# EAGLE design LooSensorNodeV0 (EAGLE 8.6.0)
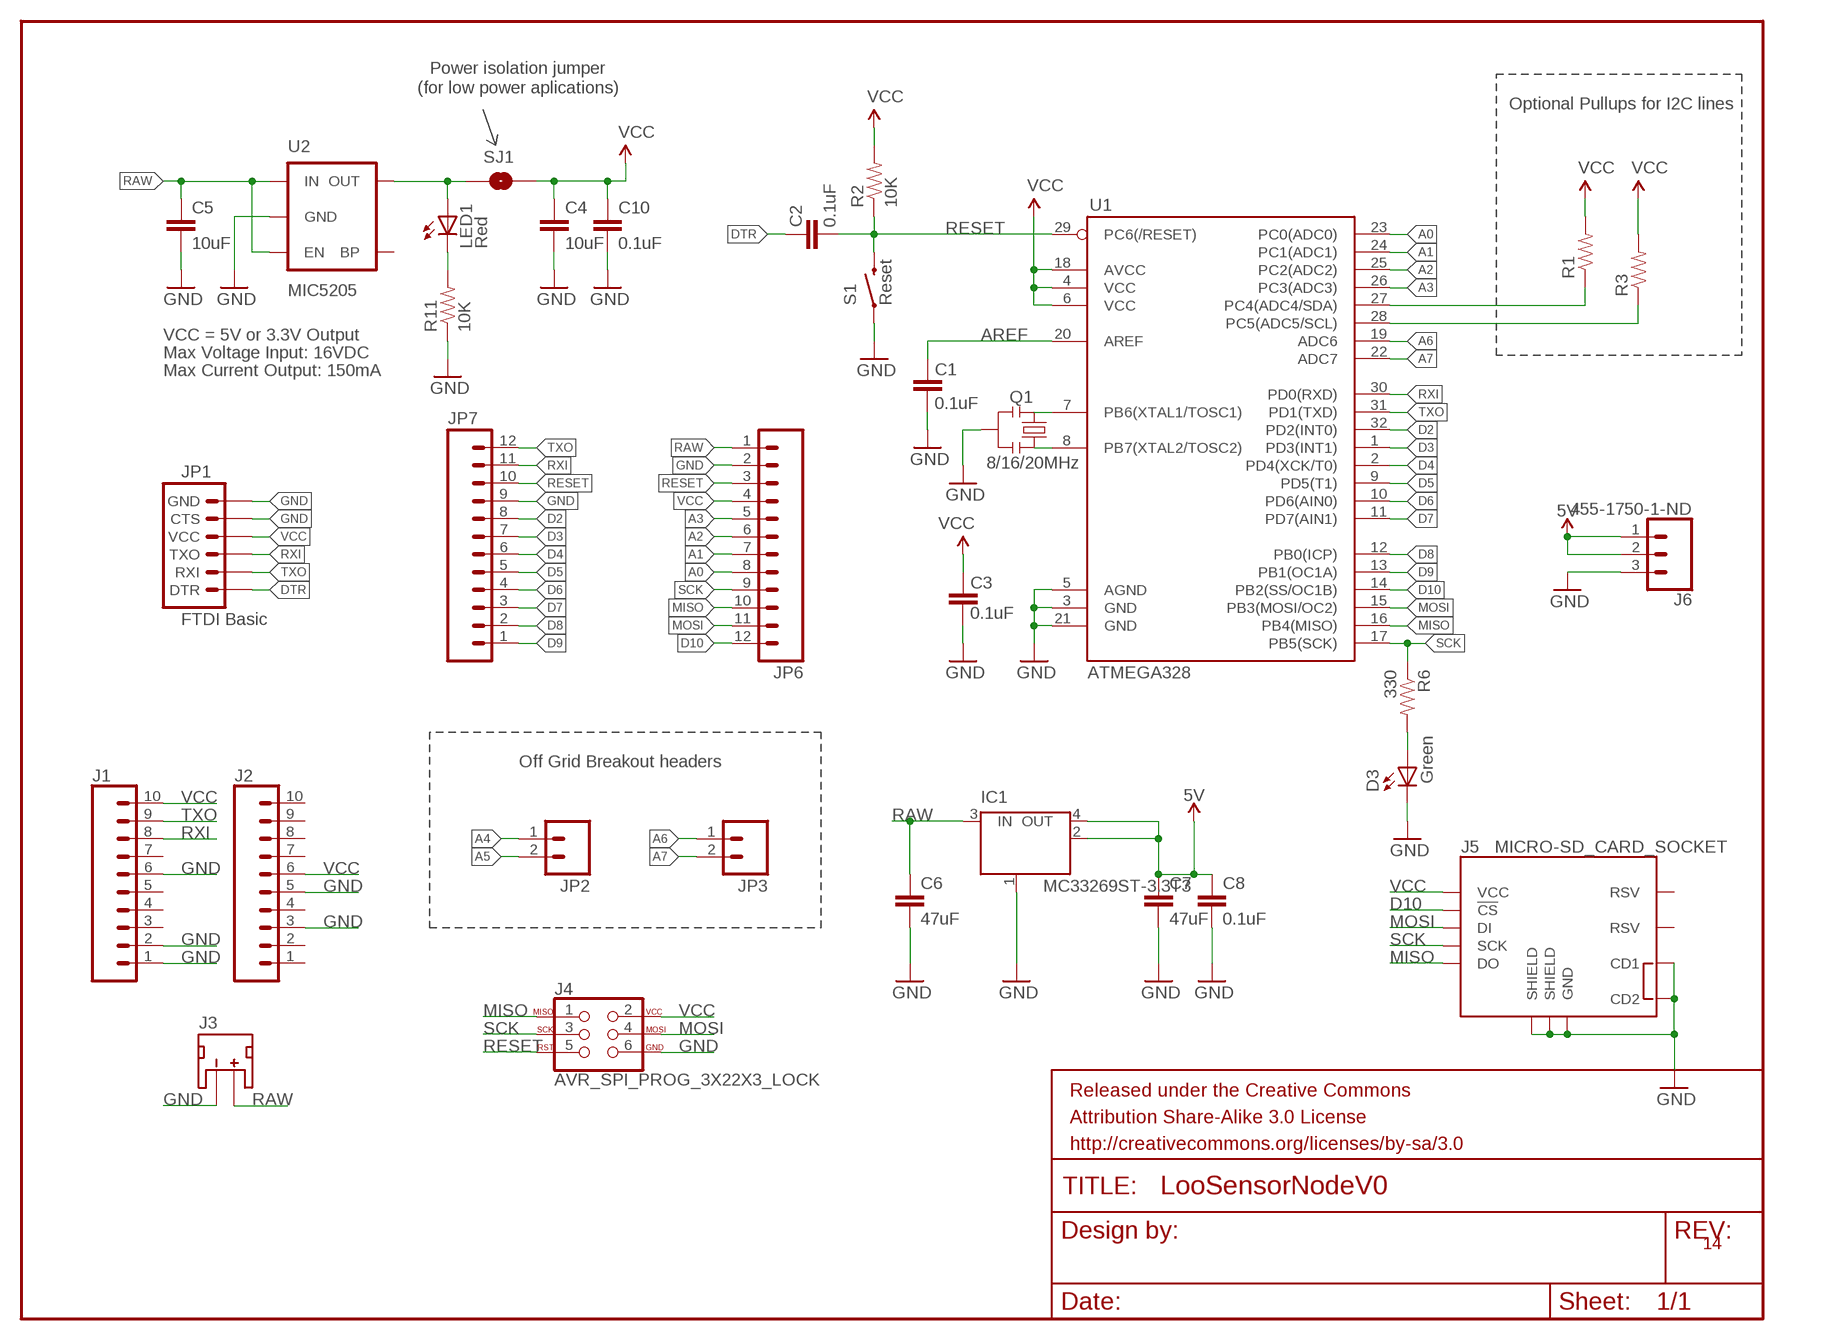
[diagram p0: schematic, sheet 1]

## Parts
C1  0.1uF  CAP0603-CAP  [0603-CAP]
C2  0.1uF  CAP0603-CAP  [0603-CAP]
C3  0.1uF  CAP0603-CAP  [0603-CAP]
C4  10uF  10UF-0603-6.3V-20%  [0603]
C5  10uF  10UF-0603-6.3V-20%  [0603]
C6  47uF  10UF-1210-50V-20%  [1210]
C7  47uF  10UF-1210-50V-20%  [1210]
C8  0.1uF  0.1UF-0603-25V-5%  [0603]
C10  0.1uF  CAP0603-CAP  [0603-CAP]
D3  Green  LED  [0603-LED-ALT1]
FRAME1  FRAME-LETTER  [CREATIVE_COMMONS]
IC1  MC33269ST-3.3T3  [SOT223]
J1  CONN_102MM  [1X10-2MM]
J2  CONN_102MM  [1X10-2MM]
J3  JST_2MM_MALE  [JST-2-SMD]
J4  AVR_SPI_PROG_3X22X3_LOCK  [2X3_LOCK]
J5  MICRO-SD_CARD_SOCKET  [MICRO-SD-SOCKET]
J6  455-1750-1-ND  CONN_03  [1X03]
JP1  FTDI Basic  ARDUINO_SERIAL_PROGRAMPTH  [1X06]
JP2  M02PTH  [1X02]
JP3  M02PTH  [1X02]
JP6  M12PTH  [1X12]
JP7  M12PTH  [1X12]
LED1  Red  LED  [0603-LED-ALT1]
Q1  8/16/20MHz  RESONATOR1:1  [RESONATOR-SMD-1:1]
R1  RESISTOR0603-RES  [0603-RES]
R2  10K  RESISTOR0603-RES  [0603-RES]
R3  RESISTOR0603-RES  [0603-RES]
R6  330  RESISTOR0603-RES  [0603-RES]
R11  10K  RESISTOR0603-RES  [0603-RES]
S1  Reset  SWITCH-MOMENTARY-2SMD-ALT01  [TACTILE-SWITCH-SMD-ALT01]
SJ1  SOLDERJUMPERNC  [SJ_2S]
U1  ATMEGA328  ATMEGA168  [TQFP32-08]
U2  MIC5205  V_REG_LDOSMD  [SOT23-5]

## Nets
5V: C7.1 C8.1 IC1.2(OUT) IC1.4(OUT) J6.1 J6.2
A0: JP6.8 U1.23(PC0(ADC0))
A1: JP6.7 U1.24(PC1(ADC1))
A2: JP6.6 U1.25(PC2(ADC2))
A3: JP6.5 U1.26(PC3(ADC3))
A4: JP2.1 R1.1 U1.27(PC4(ADC4/SDA))
A5: JP2.2 R3.1 U1.28(PC5(ADC5/SCL))
A6: JP3.1 U1.19(ADC6)
A7: JP3.2 U1.22(ADC7)
AREF: C1.2 U1.20(AREF)
D2: JP7.8 U1.32(PD2(INT0))
D3: JP7.7 U1.1(PD3(INT1))
D4: JP7.6 U1.2(PD4(XCK/T0))
D5: JP7.5 U1.9(PD5(T1))
D6: JP7.4 U1.10(PD6(AIN0))
D7: JP7.3 U1.11(PD7(AIN1))
D8: JP7.2 U1.12(PB0(ICP))
D9: JP7.1 U1.13(PB1(OC1A))
D10: J5.CS(!CS) JP6.12 U1.14(PB2(SS/OC1B))
DTR: C2.2 JP1.1(DTR)
GND [vcc]: C1.1 C3.1 C4.2 C5.2 C6.2 C7.2 C8.2 C10.2 D3.C IC1.1(GND/ADJ) J1.1 J1.2 J1.6 J2.3 J2.5 J3.1(-) J4.6 J5.CD1 J5.CD2 J5.GND J5.GND1(SHIELD) J5.GND3(SHIELD) J6.3 JP1.5(CTS) JP1.6(GND) JP6.2 JP7.9 Q1.2 R11.1 S1.1 S1.2 U1.3(GND) U1.5(AGND) U1.21(GND) U2.2(GND)
MISO: J4.1 J5.DO JP6.10 U1.16(PB4(MISO))
MOSI: J4.4 J5.DI JP6.11 U1.15(PB3(MOSI/OC2))
N$1: Q1.3 U1.8(PB7(XTAL2/TOSC2))
N$2: Q1.1 U1.7(PB6(XTAL1/TOSC1))
N$3: LED1.A SJ1.1 U2.5(OUT)
N$4: LED1.C R11.2
N$7: D3.A R6.2
RAW [vcc]: C5.1 C6.1 IC1.3(IN) J3.2(+) JP6.1 U2.1(IN) U2.3(EN)
RESET: C2.1 J4.5 JP6.3 JP7.10 R2.1 S1.3 S1.4 U1.29(PC6(/RESET))
RXI: J1.8 JP1.3(TXO) JP7.11 U1.30(PD0(RXD))
SCK: J4.3 J5.SCLK(SCK) JP6.9 R6.1 U1.17(PB5(SCK))
TXO: J1.9 JP1.2(RXI) JP7.12 U1.31(PD1(TXD))
VCC: C3.2 C4.1 C10.1 J1.10 J2.6 J4.2 J5.VCC JP1.4(VCC) JP6.4 R1.2 R2.2 R3.2 SJ1.2 U1.4(VCC) U1.6(VCC) U1.18(AVCC)
Unconnected: J1.3 J1.4 J1.5 J1.7 J2.1 J2.2 J2.4 J2.7 J2.8 J2.9 J2.10 J3.NC1(PAD1) J3.NC2(PAD2) J5.RSV1(RSV) J5.RSV2(RSV) U2.4(BP)

## Notes on the sheet
- Power isolation jumper
- (for low power aplications)
- Optional Pullups for I2C lines
- VCC = 5V or 3.3V Output
- Max Voltage Input: 16VDC
- Max Current Output: 150mA
- Off Grid Breakout headers
- 14

## Library data of the parts
C1-C3 C10 = SparkFun:CAP: Capacitor Standard 0603 ceramic capacitor, and 0.1" leaded capacitor.
C4 C5 = SparkFun-Capacitors:10UF: 10.0µF ceramic capacitors A capacitor is a passive two-terminal electrical component used to store electrical energy temporarily in an electric field.; PROD_ID: CAP-11015
C6 C7 = SparkFun-Capacitors:10UF: 10.0µF ceramic capacitors A capacitor is a passive two-terminal electrical component used to store electrical energy temporarily in an electric field.; PROD_ID: CAP-09824; VALUE: 10uF
C8 = SparkFun-Capacitors:0.1UF: 0.1µF ceramic capacitors A capacitor is a passive two-terminal electrical component used to store electrical energy temporarily in an electric field.; PROD_ID: CAP-08604
D3 LED1 = Testing:LED: LEDs Standard schematic elements and footprints for 5mm, 3mm, 1206, and 0603 sized LEDs. 5mm - Spark Fun Electronics SKU : COM-00529 (and others)
FRAME1 = SparkFun-Aesthetics:FRAME-LETTER: Schematic Frame Standard 8.5x11 US Letter frame
IC1 = linear:MC33269ST*: Adjustable Output Low Dropout Voltage Regulator 800 mA Source: http://www.onsemi.com/pub/Collateral/MC33269-D.PDF
J1 J2 = SparkFun-Connectors:CONN_10: Multi connection point. Often used as Generic Header-pin footprint for 0.1 inch spaced/style header connections On any of the 0.1 inch spaced packages, you can populate with these: Break Away Headers - Straight <https://www.sparkfun.com/products/116> (PRT-00116) Break Away Male Headers - Right Angle <https://www.sparkfun.com/products/553> (PRT-00553) Female Headers <https://www.sparkfun.com/products/115> (PRT-00115) Break Away Headers - Machine Pin <https://www.sparkfun.com/products/117> (PRT-00117) Break Away Female Headers - Swiss Machine Pin <https://www.sparkfun.com/products/743> (PRT-00743) Arduino Stackable Header - 10 Pin <https://www.sparkfun.com/products/11376> (PRT-11376) For SCREWTERMINALS and SPRING TERMINALS visit here: Screw Terimnals on SparkFun.com <https://www.sparkfun.com/search/results?term=Screw+Terminals> (5mm/3.5mm/2.54mm spacing) This device is also useful as a general connection point to wire up your design to another part of your project. Our various solder wires solder well into these plated through hole pads. Hook-Up Wire - Assortment (Stranded, 22 AWG) <https://www.sparkfun.com/products/11375> (PRT-11375) Hook-Up Wire - Assortment (Solid Core, 22 AWG) <https://www.sparkfun.com/products/11367> (PRT-11367) View the entire wire category on our website here <https://www.sparkfun.com/categories/141> Special notes: Molex polarized connector foot print use with SKU : PRT-08231 with associated crimp pins and housings. 1MM SMD Version SKU: PRT-10208 NOTES ON THE VARIANTS LOCK and LOCK_LONGPADS... This footprint was designed to help hold the alignment of a through-hole component (i.e. 6-pin header) while soldering it into place. You may notice that each hole has been shifted either up or down by 0.005 of an inch from it's more standard position (which is a perfectly straight line). This slight alteration caused the pins (the squares in the middle) to touch the edges of the holes. Because they are alternating, it causes a "brace" to hold the component in place. 0.005 has proven to be the perfect amount of "off-center" position when using our standard breakaway headers. Although looks a little odd when you look at the bare footprint, once you have a header in there, the alteration is very hard to notice. Also,if you push a header all the way into place, it is covered up entirely on the bottom side.; PROD_ID: CONN-08875; SF_ID: PRT-08272
J3 = SparkFun-Connectors:JST_2MM_MALE: JST 2MM MALE RA CONNECTOR Two pin, compact surface mount connector. Commonly used as a battery input connection point. We really like the solid locking feeling and high current rating on these small connectors. We use these all the time as battery connectors. Mates to single-cell LiPo batteries. Here is the connector we sell at SparkFun: JST Right Angle Connector - White <https://www.sparkfun.com/products/8612> (PRT-08612) Datasheet <http://www.sparkfun.com/datasheets/Prototyping/Connectors/JST-Horizontal.pdf> It was used on these SparkFun products: SparkFun MOSFET Power Controller <https://www.sparkfun.com/products/11214> (PRT-11214) SparkFun Battery Babysitter - LiPo Battery Manager <https://www.sparkfun.com/products/13777> (PRT-13777) And many, many others that required a lipo battery connection.; PROD_ID: CONN-11443; SF_ID: PRT-08612
J4 = SparkFun-Connectors:AVR_SPI_PROG_3X2: AVR ISP 6 Pin This is the reduced ISP connector for AVR programming. Common on Arduino. This footprint will take up less PCB space and can be used with a 10-pin to 6-pin adapter such as SKU: BOB-08508 **Special note about "TEST_POINT" package. The stop mask is on the top side, so if you want your programming test points to be on the bottom of your board, make sure to place this package on the bottom side of the board. This also ensure that the orientation to program from the bottom side will be correct. SparkFun Products: SparkFun ISP Pogo Adapter <https://www.sparkfun.com/products/11591> - NS Tiny AVR Programmer <https://www.sparkfun.com/products/11801> -PTH
J5 = SparkFun-Connectors:MICRO-SD_CARD_SOCKET: microSD Socket for Transflash Push-push type µSD socket. tDoc lines correctly indicate media card edge positions when inserting (unlocked, locked, depressed). NOTE: CD1 and CD2 are connected internally, and the default detect state of the socket is detect pin to ground. SparkFun Products: WAV Trigger <https://www.sparkfun.com/products/13660> CAN-Bus Shield <https://www.sparkfun.com/products/13262> SparkFun Level Shifing microSD Breakout <https://www.sparkfun.com/products/13743>; PROD_ID: CONN-07820; SF_ID: PRT-00127
J6 = SparkFun-Connectors:CONN_03: Multi connection point. Often used as Generic Header-pin footprint for 0.1 inch spaced/style header connections On any of the 0.1 inch spaced packages, you can populate with these: Break Away Headers - Straight <https://www.sparkfun.com/products/116> (PRT-00116) Break Away Male Headers - Right Angle <https://www.sparkfun.com/products/553> (PRT-00553) Female Headers <https://www.sparkfun.com/products/115> (PRT-00115) Break Away Headers - Machine Pin <https://www.sparkfun.com/products/117> (PRT-00117) Break Away Female Headers - Swiss Machine Pin <https://www.sparkfun.com/products/743> (PRT-00743) Stackable Header - 3 Pin (Female, 0.1") <https://www.sparkfun.com/products/13875> (PRT-13875) For SCREWTERMINALS and SPRING TERMINALS visit here: Screw Terimnals on SparkFun.com <https://www.sparkfun.com/search/results?term=Screw+Terminals> (5mm/3.5mm/2.54mm spacing) This device is also useful as a general connection point to wire up your design to another part of your project. Our various solder wires solder well into these plated through hole pads. Hook-Up Wire - Assortment (Stranded, 22 AWG) <https://www.sparkfun.com/products/11375> (PRT-11375) Hook-Up Wire - Assortment (Solid Core, 22 AWG) <https://www.sparkfun.com/products/11367> (PRT-11367) View the entire wire category on our website here <https://www.sparkfun.com/categories/141> Special notes: Molex polarized connector foot print use with SKU : PRT-08232 with associated crimp pins and housings.; PROD_ID: XXX-00000
JP1 = SparkFun:ARDUINO_SERIAL_PROGRAM
JP2 JP3 = SparkFun:M02: Header 2 Standard 2-pin 0.1" header. Use with straight break away headers (SKU : PRT-00116), right angle break away headers (PRT-00553), swiss pins (PRT-00743), machine pins (PRT-00117), and female headers (PRT-00115). Molex polarized connector foot print use with SKU : PRT-08233 with associated crimp pins and housings.
JP6 JP7 = SparkFun:M12: Header 12 Standard 12-pin 0.1" header. Use with straight break away headers (SKU : PRT-00116), right angle break away headers (PRT-00553), swiss pins (PRT-00743), machine pins (PRT-00117), and female headers (PRT-00115).
Q1 = Testing:RESONATOR: Resonator Small SMD resonator. This is the itty bitty 10/20MHz resonators with built in caps. CSTCE10M0G55 and CSTCE20M0V53. Footprint for SMD has been used in SFE production for years, and does work okay. 1:1 is an attempt to get larger fillets on the sides so it will be easier to inspect these solders in our AOI machine. The pads have been minimized to match the actual metal under the resonator. To see this relation, it includes an image import of the bottom side of the component. Imported to scale on layer 200.
R1-R3 R6 R11 = SparkFun:RESISTOR: Resistor Basic schematic elements and footprints for 0603, 1206, and PTH resistors.
S1 = Testing:SWITCH-MOMENTARY-2: Various NO switches- pushbuttons, reed, etc
SJ1 = SparkFun-Passives:SOLDERJUMPER: Solder Jumper Standard SMD solder jumper. Used to automate production. Two varients : Normally Open and Normally Closed are the same, but have different paste layers. NC will have a large amount of paste and should jumper during reflow.
U1 = SparkFun:ATMEGA168
U2 = SparkFun:V_REG_LDO: Voltage Regulator LDO Standard 150mA LDO voltage regulator in SOT-23 layout. Micrel part MIC5205. BP (by-pass) pin is used to lower output noise with 470pF cap.

## Net classes
0 default: width 0.203 mm
1 vcc: width 0.254 mm

## Board
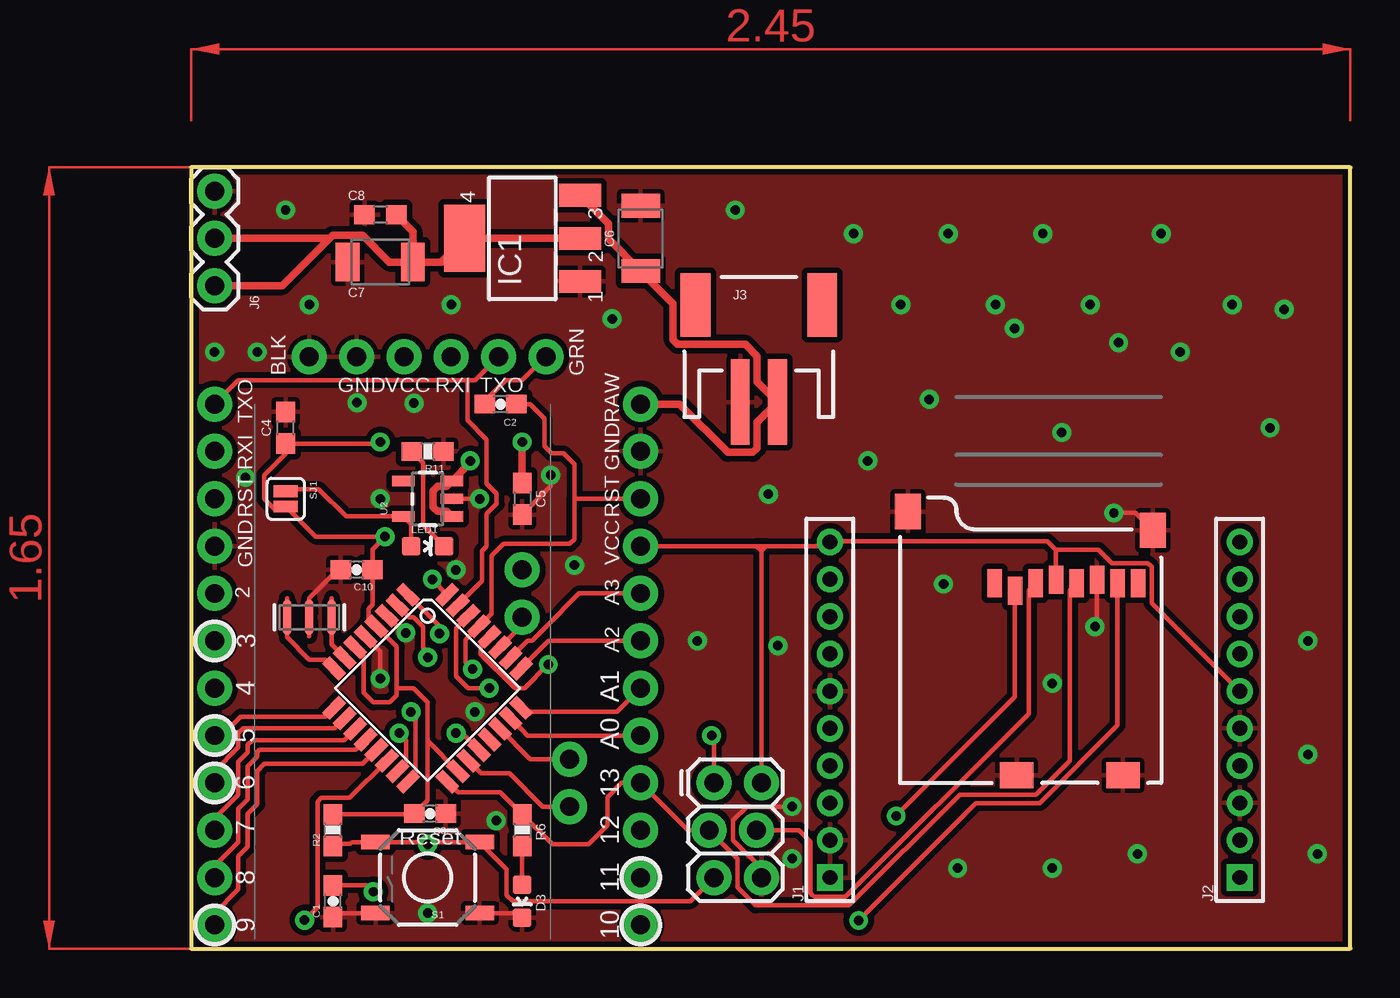
[diagram p1: board, top side]
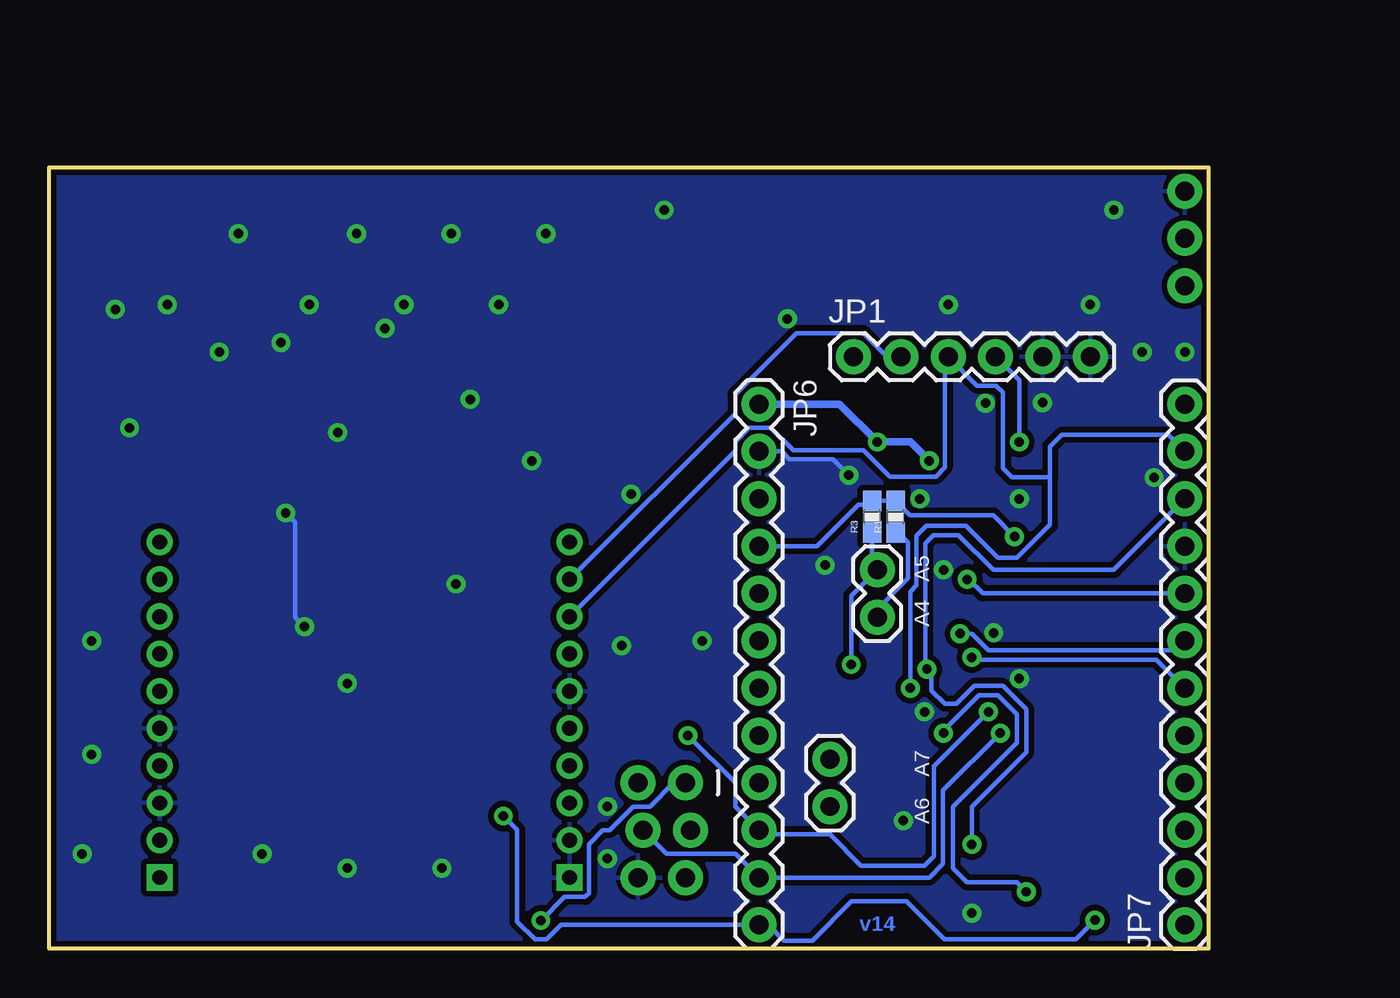
[diagram p2: board, bottom side, seen from below]

Size 62.23 x 41.91 mm. Coordinates in mm from the lower left corner, seen from the top.
Outline: 0,41.91 0,0 62.23,0 62.23,41.91 0,41.91
Copper layers (1*16): Top 0.035mm / dielectric 1.5mm / Bottom 0.035mm
Design rules "SparkFun-2-layer *": minimum track width 7mil, minimum drill 15mil, track to track 8mil, track to pad 8mil, pad to pad 8mil, via to via 8mil, smd to smd 8mil, copper to edge 8mil, drill to drill 8mil, minimum pad ring 12mil, minimum via ring 10mil, stop-mask expansion 4mil, vias tented up to drill 20mil, thermal gap 10mil

### Footprints (pad centres in the part's own frame; a part is rotated, then mirrored left to right if it is on the bottom)
0603-CAP = smd 1.1 x 1: 1 -0.85,0; 2 0.85,0
0603 = smd 1.1 x 1: 1 -0.85,0; 2 0.85,0
1210 = smd 1.27 x 2.06: 1 -1.755,0; 2 1.755,0
0603-LED-ALT1 = smd 1 x 1: A 0,-0.877; C 0,0.877
SOT223 = smd 1.219 x 2.235: 1 -2.311,-3.099; 2 0,-3.099; 3 2.311,-3.099 | smd 3.6 x 2.2: 4 0,3.099
1X10-2MM = drill 0.8 square: 1 0,0 | drill 0.8: 2 2,0; 3 4,0; 4 6,0; 5 8,0; 6 10,0; 7 12,0; 8 14,0; 9 16,0; 10 18,0
JST-2-SMD = smd 1 x 4.6: 1 -1,-3.7; 2 1,-3.7 | smd 1.6 x 3.4: NC1 -3.4,1.5; NC2 3.4,1.5
2X3_LOCK = drill 1.016 pad 1.88: 1 0,0.127; 2 0,2.667; 3 2.54,-0.127; 4 2.54,2.413; 5 5.08,0.127; 6 5.08,2.667
MICRO-SD-SOCKET = smd 1.8 x 1.4: CD1 -2.05,0.4; CD2 -7.75,0.4 | smd 0.8 x 1.5: CS -7.84,10.3; DI -6.74,10.7; DO -2.34,10.7; GND -3.44,10.9; RSV1 -8.94,10.7; RSV2 -1.24,10.7; SCLK -4.54,10.7; VCC -5.64,10.9 | smd 1.4 x 1.9: GND1 -13.6,14.55; GND3 -0.45,13.55
1X03 = drill 1.016 pad 1.88: 1 0,0; 2 2.54,0; 3 5.08,0
1X06 = drill 1.016 pad 1.88: 1 0,0; 2 2.54,0; 3 5.08,0; 4 7.62,0; 5 10.16,0; 6 12.7,0
1X02 = drill 1.016 pad 1.88: 1 0,0; 2 2.54,0
1X12 = drill 1.016 pad 1.88: 1 0,0; 2 2.54,0; 3 5.08,0; 4 7.62,0; 5 10.16,0; 6 12.7,0; 7 15.24,0; 8 17.78,0; 9 20.32,0; 10 22.86,0; 11 25.4,0; 12 27.94,0
RESONATOR-SMD-1:1 = smd 0.45 x 1.905: 1 -1.2,0; 2 0,0; 3 1.2,0
0603-RES = smd 1.1 x 1: 1 -0.85,0; 2 0.85,0
TACTILE-SWITCH-SMD-ALT01 = smd 1.524 x 0.762: 1 -2.794,1.905; 2 2.794,1.905; 3 -2.794,-1.905; 4 2.794,-1.905
SJ_2S = smd 0.635 x 1.27: 1 -0.412,0; 2 0.412,0
TQFP32-08 = smd 1.27 x 0.559: 1 -4.293,2.8; 2 -4.293,2; 3 -4.293,1.2; 4 -4.293,0.4; 5 -4.293,-0.4; 6 -4.293,-1.2; 7 -4.293,-2; 8 -4.293,-2.8; 17 4.293,-2.8; 18 4.293,-2; 19 4.293,-1.2; 20 4.293,-0.4; 21 4.293,0.4; 22 4.293,1.2; 23 4.293,2; 24 4.293,2.8 | smd 0.559 x 1.27: 9 -2.8,-4.293; 10 -2,-4.293; 11 -1.2,-4.293; 12 -0.4,-4.293; 13 0.4,-4.293; 14 1.2,-4.293; 15 2,-4.293; 16 2.8,-4.293; 25 2.8,4.293; 26 2,4.293; 27 1.2,4.293; 28 0.4,4.293; 29 -0.4,4.293; 30 -1.2,4.293; 31 -2,4.293; 32 -2.8,4.293
SOT23-5 = smd 0.55 x 1.2: 1 -0.95,-1.3; 2 0,-1.3; 3 0.95,-1.3; 4 0.95,1.3; 5 -0.95,1.3

### Placement (x,y rotation side)
C1  7.62,2.54 90 top
C2  16.61,29.21 180 top
C3  12.83,7.24 180 top
C4  5.08,27.94 90 top
C5  17.78,24.13 270 top
C6  24.13,38.1 90 top
C7  10.16,36.83 180 top
C8  10.16,39.37 180 top
C10  8.89,20.32 180 top
D3  17.78,2.54 180 top
FRAME1  -15.98,-8.89 0 top  (outside the outline)
IC1  17.78,38.1 90 top
J1  34.29,3.81 90 top
J2  56.29,3.81 90 top
J3  30.48,33.02 0 top
J4  27.94,8.89 270 top
J5  52.07,8.89 0 top
J6  1.27,35.56 90 top
JP1  19.05,31.75 0 bottom
JP2  17.78,17.78 90 bottom
JP3  20.32,7.62 90 bottom
JP6  24.13,29.21 270 bottom
JP7  1.27,1.27 90 bottom
LED1  12.7,21.59 270 top
Q1  6.35,17.78 180 top
R1  16.79,23.16 90 bottom
R2  7.62,6.35 90 top
R3  18.06,23.16 90 bottom
R6  17.78,6.35 270 top
R11  12.7,26.67 180 top
S1  12.7,3.81 180 top
SJ1  5.08,24.13 270 top
U1  12.7,13.97 315 top
U2  12.7,24.13 90 top

### Tracks (layer width: path | path; a pad name or v marks a point on that pad's centre or on a via)
5V
  Top 0.406: IC1.2 IC1.4 13.41,36.83 C7.1 | C8.1 11.91,38.47 C7.1 | C7.1 10.64,36.83 9.21,38.27 7.6,38.27 7.43,38.1 | J6.2 7.43,38.1 | J6.1 4.89,35.56 7.43,38.1
A0
  Top 0.254: 18.07,11.43 JP6.8 | U1.23 17.8,11.7 18.07,11.43 | 18.07,11.43
A1
  Top 0.254: U1.24 17.71,12.77 17.78,12.7 22.86,12.7 JP6.7
A2
  Top 0.254: U1.25 19.2,16.51 JP6.6
A3
  Top 0.254: U1.26 18.07,16.51 18.31,16.51 19.05,17.25 19.05,17.27 20.83,19.05 JP6.5
A4
  Top 0.254: U1.27 17.4,16.97 | 17.4,16.97 | JP2.1 17.78,17.35 17.4,16.97
  Bottom 0.254: 16.79,22.46 16.13,21.8 16.13,21.08 16.13,19.86 17.78,18.21 JP2.1 | R1.1 16.79,22.46 | 16.79,22.46 16.84,22.52
A5  (via drill 0.51)
  Top 0.254: v19.18,15.24 17.91,13.97 17.4,13.97 17.27,14.1 17.25,14.1 15.54,15.8 15.54,16.25 U1.28 | U1.28
  Bottom 0.254: R3.1 18.06,20.6 JP2.2 19.18,18.92 v19.18,15.24
A6
  Top 0.254: JP3.1 18.88,7.62 17.1,9.4 15.57,9.4 U1.19
A7
  Top 0.254: JP3.2 18.21,10.16 | 18.21,10.16 | 18.21,10.16 U1.22
AREF  (via drill 0.51)
  Top 0.254: 14.55,11.56 v14.22,11.56 14.55,11.56 | U1.20 14.55,11.56 | v9.78,3.05 9.44,3.39 C1.2
  Bottom 0.254: v14.22,11.56 14.22,11.68 12.32,13.59 11.3,13.59 10.29,12.57 10.29,11.05 13.72,7.62 13.72,4.32 12.95,3.56 10.29,3.56 v9.78,3.05
D2  (via drill 0.51)
  Top 0.254: U1.32 12.95,19.79 v12.95,19.81
  Bottom 0.254: JP7.8 12.12,19.05 12.88,19.81 v12.95,19.81
D3  (via drill 0.51)
  Top 0.254: 13.34,17.3 v13.34,16.89 13.34,17.3 | U1.1 13.34,17.3
  Bottom 0.254: JP7.7 1.78,16 11.81,16 12.7,16.89 v13.34,16.89
D4  (via drill 0.51)
  Top 0.254: v12.7,15.62 12.95,15.62 12.45,16.13 12.45,17.27 11.94,17.78 11.72,17.78 | U1.2 11.72,17.78 | 11.72,17.78
  Bottom 0.254: JP7.6 2.79,15.49 12.57,15.49 v12.7,15.62
D5
  Top 0.254: JP7.5 1.65,11.43 2.67,12.45 7.22,12.45 U1.9
D6
  Top 0.254: 1.27,9.18 JP7.4 1.27,9.53 2.54,10.79 2.54,11.56 2.79,11.81 7.71,11.81 | U1.10 7.71,11.81 | 7.71,11.81
D7
  Top 0.254: JP7.3 1.27,6.99 2.54,8.26 2.54,10.03 3.05,10.54 3.05,10.92 3.3,11.18 8.21,11.18 U1.11
D8
  Top 0.254: JP7.2 1.27,4.45 2.54,5.71 2.54,7.49 3.05,8 3.05,9.78 3.56,10.29 3.56,10.54 3.68,10.67 8.83,10.67 U1.12
D9
  Top 0.254: JP7.1 1.27,1.91 2.54,3.17 2.54,4.95 3.05,5.46 3.05,7.24 3.56,7.75 3.56,9.53 3.94,9.91 9.2,9.91 U1.13
D10  (via drill 0.51)
  Top 0.254: v6.1,1.52 6.79,2.22 6.79,7.89 6.98,8.08 8.51,8.08 U1.14 | J5.CS 44.23,13.5 v37.85,7.11
  Bottom 0.254: v6.1,1.52 7.11,0.51 14.19,0.51 16.22,2.54 19.15,2.54 21.26,0.43 22.78,0.43 23.62,1.27 JP6.12 34.74,1.27 35.52,0.49 36.15,0.49 37.1,1.44 37.1,6.37 v37.85,7.11
DTR
  Top 0.254: JP1.1 17.78,30.48 16.89,30.48 15.76,29.35 C2.2
GND  (via drill 0.51)
  Top 0.254: v15.49,24.13 13.97,24.13 | U1.3 11.48,16.89 11.56,16.89 | C1.1 7.83,1.91 S1.2 | U1.5 10.16,15.94 v10.16,14.48 | D3.C 17.54,1.91 S1.1 | Q1.2 6.35,18.8 7.87,20.32 C10.2 | J4.6 30.61,4.3 29.08,5.82 29.08,6.88 29.83,7.62 v32.26,7.62 | J5.GND 48.63,17.39 v48.51,17.27 | v49.53,23.37 50.69,23.37 J5.GND3 | C5.2 19.3,24.8 v19.3,25.4
  Bottom 0.254: v48.51,17.27 49.02,17.78 49.02,22.86 v49.53,23.37 | v19.3,25.4 20.17,26.26 22.48,26.26 22.88,26.67 JP6.2
  other vias: 15.24,12.7 12.7,1.91 8.92,29.29 14.22,20.32 11.53,16.94 2.92,25.27 10.16,24.13 11.96,29.26 16.38,6.86 20.57,20.57 41.15,4.32 50.8,5.08 30.99,24.38 31.5,16.26 27.18,16.51 46.23,14.22 40.39,19.56 36.32,26.16 46.23,4.32 60.45,5.08 59.94,10.41 59.94,16.51 39.62,29.46 44.2,33.27 53.09,32 46.74,27.69 57.91,27.94 58.67,34.29 49.78,32.51 38.1,34.54 22.61,33.78 3.56,32 32.26,4.83 35.56,38.35 40.64,38.35 43.18,34.54 45.72,38.35 48.26,34.54 52.07,38.35 55.88,34.54 29.21,39.62 13.97,34.54 5.08,39.62 1.27,32 6.35,34.54
  pour Top (isolate 0.305): -3.81,45.72 64.77,45.72 64.77,0 -3.81,0
  pour Bottom (isolate 0.305): 0,44.45 63.5,44.45 63.5,0 0,0
MISO  (via drill 0.51)
  Top 0.254: U1.16 12.06,9.38 12.06,12.45 v11.81,12.7 | J4.1 28.07,11.3 v27.94,11.43 | v35.83,1.5 42.13,7.8 45.55,7.8 49.73,11.99 J5.DO
  Bottom 0.254: v11.81,12.7 14.73,9.78 14.73,4.95 15.24,4.45 18.64,4.45 20.32,6.12 23.9,6.12 JP6.10 25.4,7.62 25.4,8.89 v27.94,11.43 | v35.83,1.5 34.56,2.77 33.45,2.77 33.26,2.97 33.26,5.61 32.51,6.35 32.15,6.35 30.88,7.62 29.97,7.62 28.7,8.89 J4.1
MOSI  (via drill 0.51)
  Top 0.254: v11.18,11.56 11.56,11.18 11.56,10 U1.15 | J5.DI 44.96,19.22 44.96,12.6 35.13,2.77 33.45,2.77 33.35,2.87 33.26,2.97 33.26,5.73 32.64,6.35 J4.4
  Bottom 0.254: v11.18,11.56 14.25,8.48 14.25,4.55 14.99,3.81 JP6.11 25.4,5.08 29.08,5.08 J4.4
N$1
  Top 0.254: Q1.3 5.15,16.69 6.35,15.49 7.22,15.49 U1.8
N$2
  Top 0.254: 7.97,15.87 U1.7 8.25,15.63 7.55,16.33 Q1.1
N$3
  Top 0.254: SJ1.1 5.18,24.64 6.86,24.64 8.32,23.18 U2.5 11.82,22.76 LED1.A
N$4
  Top 0.254: R11.2 12.45,26.07 12.45,22.72 LED1.C
N$7
  Top 0.254: D3.A R6.2
RAW  (via drill 0.51)
  Top 0.254: U2.3 14,25.13 14.02,25.15
  Top 0.406: IC1.3 22.4,38.88 22.4,38.07 C6.1 25.87,34.6 25.87,32.65 26.11,32.41 29.76,32.41 30.39,31.79 30.39,30.41 J3.2 30.39,28.23 30.39,26.85 30.15,26.61 28.81,26.61 26.21,29.21 JP6.1 | U2.1 13.73,23.45 13.23,23.45 12.99,23.69 12.99,24.57 13.23,24.81 13.73,24.81 U2.3 14.99,26.07 v14.99,26.16 | C5.1 v17.78,27.18
  Bottom 0.406: v14.99,26.16 16,27.18 v17.78,27.18 19.81,29.21 JP6.1
RESET  (via drill 0.51)
  Top 0.254: 20.57,24.13 JP6.3 | 20.57,24.13 20.57,21.97 20.32,21.72 16.76,21.72 16.13,21.08 16.13,17.96 U1.29 | v15.11,14.99 14.73,15.37 14.73,16.57 U1.29 | C2.1 18.19,29.21 18.97,28.42 18.97,26.95 19.36,26.56 19.99,26.56 20.57,25.97 20.57,24.13 | R2.1 7.74,5.62 8.54,5.62 8.64,5.71 S1.4 12.57,5.71 v12.7,5.59 12.83,5.71 S1.3 16.95,4.26 16.95,2.87 17.28,2.54 26.8,2.54 J4.5 | U1.29
  Bottom 0.254: v12.7,5.59 12.7,7.62 9.78,10.54 9.78,12.83 11.05,14.1 12.57,14.1 13.53,13.14 14.16,13.14 14.86,13.84 14.86,14.73 v15.11,14.99 15.19,15.06 15.19,21.74 14.76,22.17 13.41,22.17 11.56,20.32 5.08,20.32 JP7.10
RXI  (via drill 0.51)
  Top 0.254: v16,13.97 14.86,13.97 14.22,14.61 14.22,17.19 U1.30 | U1.30
  Bottom 0.254: v16,13.97 16,19.15 15.67,19.48 15.67,22.15 15.14,22.68 13.03,22.68 11.3,20.95 10.29,20.95 8.51,22.73 8.51,25.27 | JP7.11 2.16,27.56 7.87,27.56 8.51,26.92 8.51,25.27 | 8.51,25.27 10.54,25.27 11.05,25.78 11.05,29.84 11.4,30.2 12.42,30.2 JP1.3 14.15,31.57 14.15,25.82 14.64,25.32 17.11,25.32 18.51,26.72 22.29,26.72 23.51,27.94 24.66,27.94 25.4,27.2 25.4,26.7 J1.8
SCK
  Top 0.254: U1.17 14.33,8.38 16.6,8.38 R6.1 19.39,5.59 21.34,5.59 22.35,6.6 22.35,8.13 23.11,8.89 JP6.9 26.67,6.35 J4.3 29.34,4.83 29.34,3.28 30.3,2.32 35.32,2.32 41.26,8.26 45.36,8.26 47.16,10.06 47.16,19.22 J5.SCLK
TXO
  Top 0.254: JP7.12 2.54,30.48 14.83,30.48 | 14.83,30.48 15.24,30.48 JP1.2 | 15.62,19.72 15.62,21.34 15.88,21.59 15.88,23.32 16.41,23.85 16.41,24.41 15.88,24.94 15.88,27.3 14.83,28.35 14.83,30.48 | U1.31 15.62,19.72 | 15.62,19.72
  Bottom 0.254: J1.9 25.4,28.7 25.4,29.74 22.12,33.02 18.52,33.02 17.25,31.75 JP1.2
VCC  (via drill 0.51)
  Top 0.254: 12.7,11.14 12.75,11.1 12.7,11.05 | 12.7,11.05 12.7,11.14 | 12.7,11.14 12.7,13.21 11.94,13.97 11.05,13.97 | 11.05,13.97 11.05,13.59 10.67,13.21 9.78,13.21 9.27,13.72 9.27,15.7 U1.6 | 11.05,13.97 11.05,16.19 U1.4 | 12.7,11.05 12.7,7.96 C3.2 11.94,7.2 R2.2 | U1.18 12.7,11.14 | 9.95,17.31 U1.4 | v10.16,27.18 10.07,27.09 C4.1 5.08,26.54 3.94,25.4 3.94,24.13 4.45,23.62 5.18,23.62 SJ1.2 6.7,22.1 v10.41,22.1 9.74,21.42 C10.1 9.74,18.45 9.54,18.24 9.54,17.7 U1.4 | JP6.4 30.35,21.59 | 30.35,21.59 30.48,21.59 | 30.48,21.59 30.73,21.59 | 30.73,21.59 30.86,21.59 | 30.86,21.59 34.07,21.59 J1.10 34.32,21.84 45.97,21.84 46.43,21.39 | J4.2 30.61,21.34 | 30.61,21.34 30.61,21.46 | 30.61,21.46 30.73,21.59 | 30.61,21.46 30.48,21.59 | 30.61,21.34 30.86,21.59 | 30.61,21.34 30.35,21.59 | J5.VCC 46.43,21.39 | 46.43,21.39 48.71,21.39 49.43,20.67 51.37,20.67 51.56,20.48 51.56,18.54 J2.6
  Bottom 0.254: v10.16,27.18 10.16,30.48 JP1.4 | JP6.4 21.01,21.59 18.8,23.8 18.27,23.8 R3.2 R1.2 16.02,23.24 11.56,23.24 v10.41,22.1
(copper drawn outside any net)
  shapes: Top area x2

### Text on the board
Bottom: v14
tPlace: BLK | GRN | GND | VCC | RXI | TXO | TXO | RAW | RXI | GND | RST | RST | VCC | GND | 2 | A3 | 3 | A2 | 4 | A1 | 5 | A0 | 6 | 13 | 7 | Reset | 12 | 8 | 11 | 9 | 10
bPlace: A5 | A4 | A7 | A6
tValues: Arduino Pro Mini
tDocu: Original Arduino Mini Design by Team Arduino / Arduino Pro Mini Design by SparkFun Electronics / Revised by Pete Lewis / Revised by Brandon Ng